# Altium schematic sheet MOTOR_CONTROL.SchDoc
size 558 x 431 mm; SheetNumber: 13; SheetTotal: 25; Sheet_Name: MOTOR CONTROL; Size: 11x17
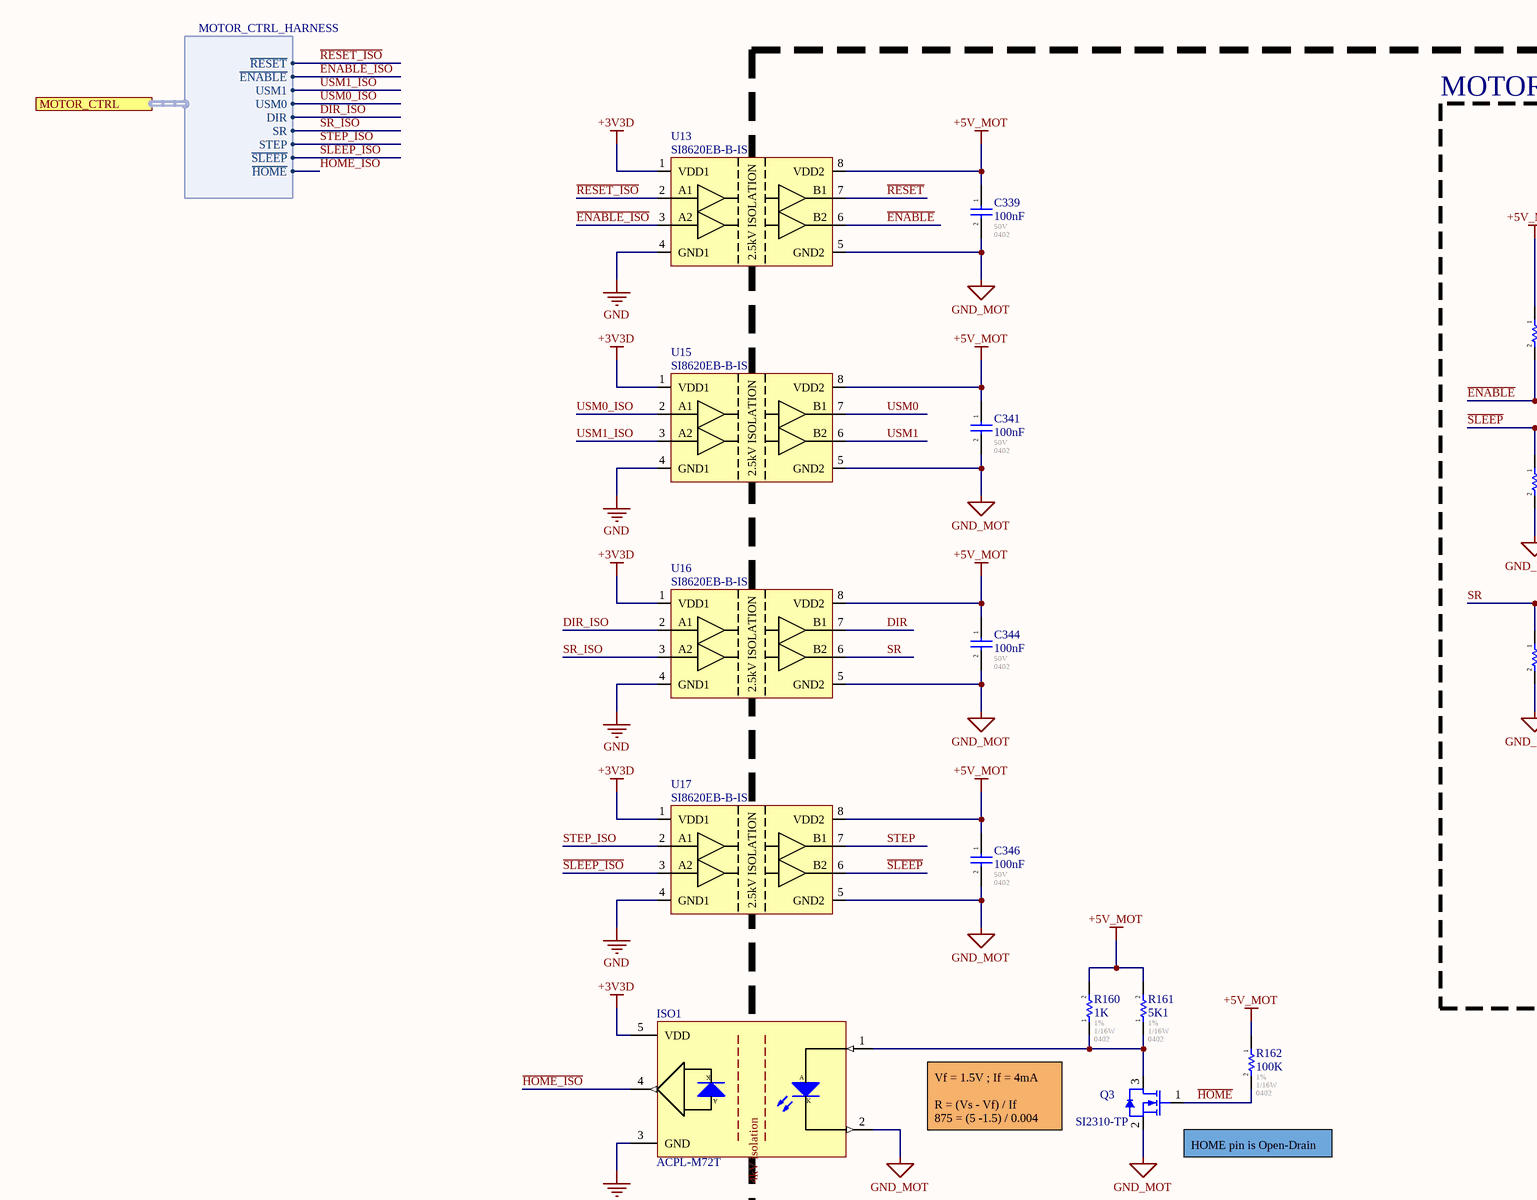
[diagram p0: MOTOR_CONTROL.SchDoc, top left]
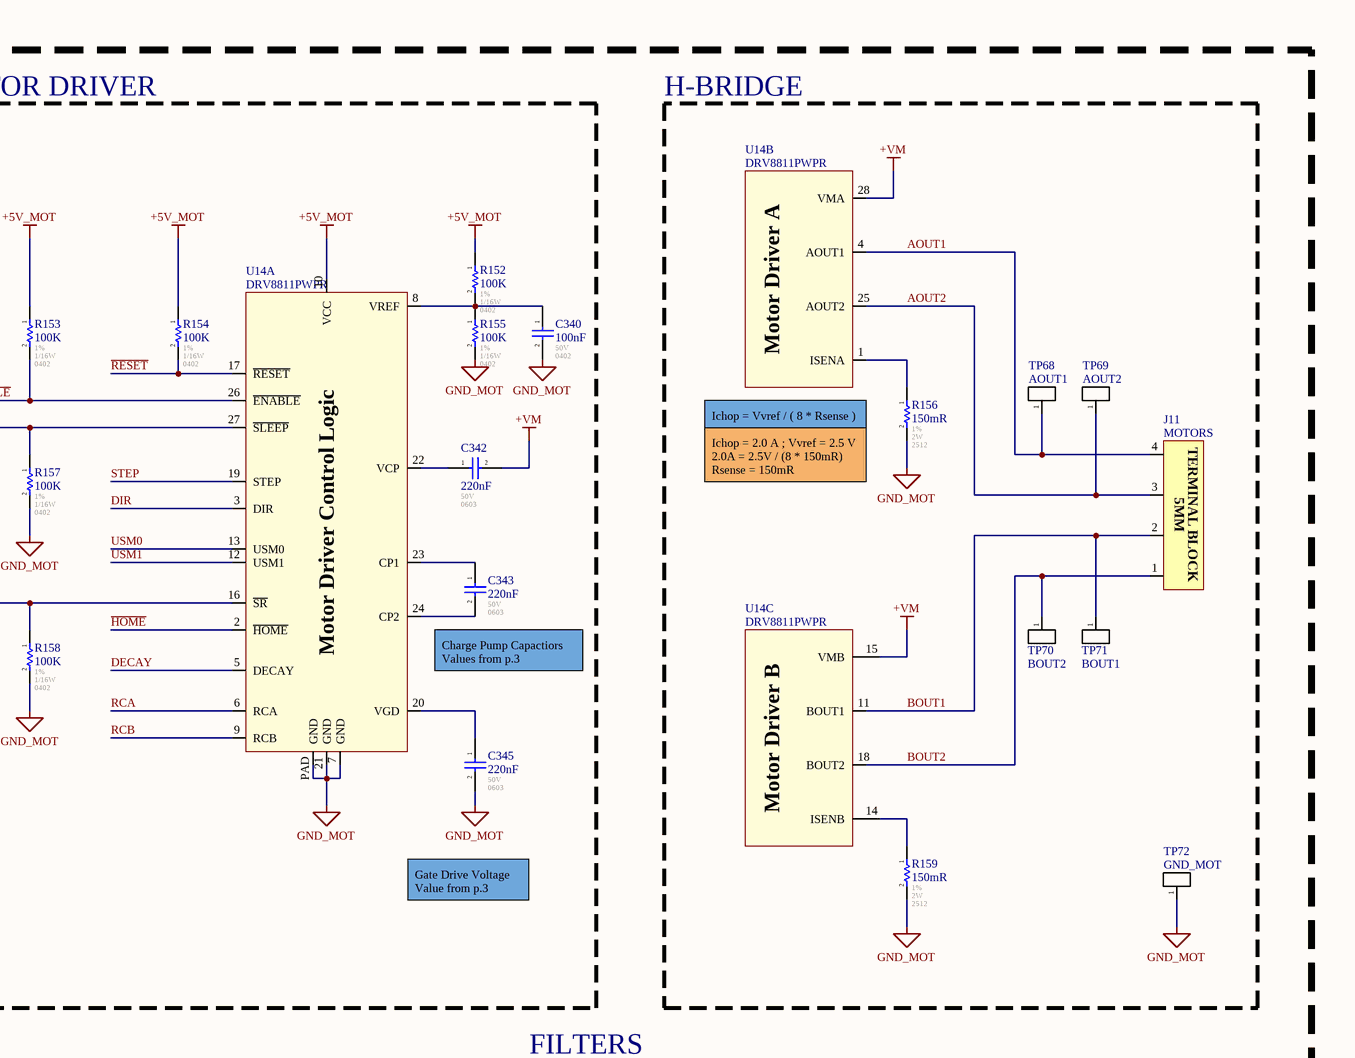
[diagram p1: MOTOR_CONTROL.SchDoc, top right]
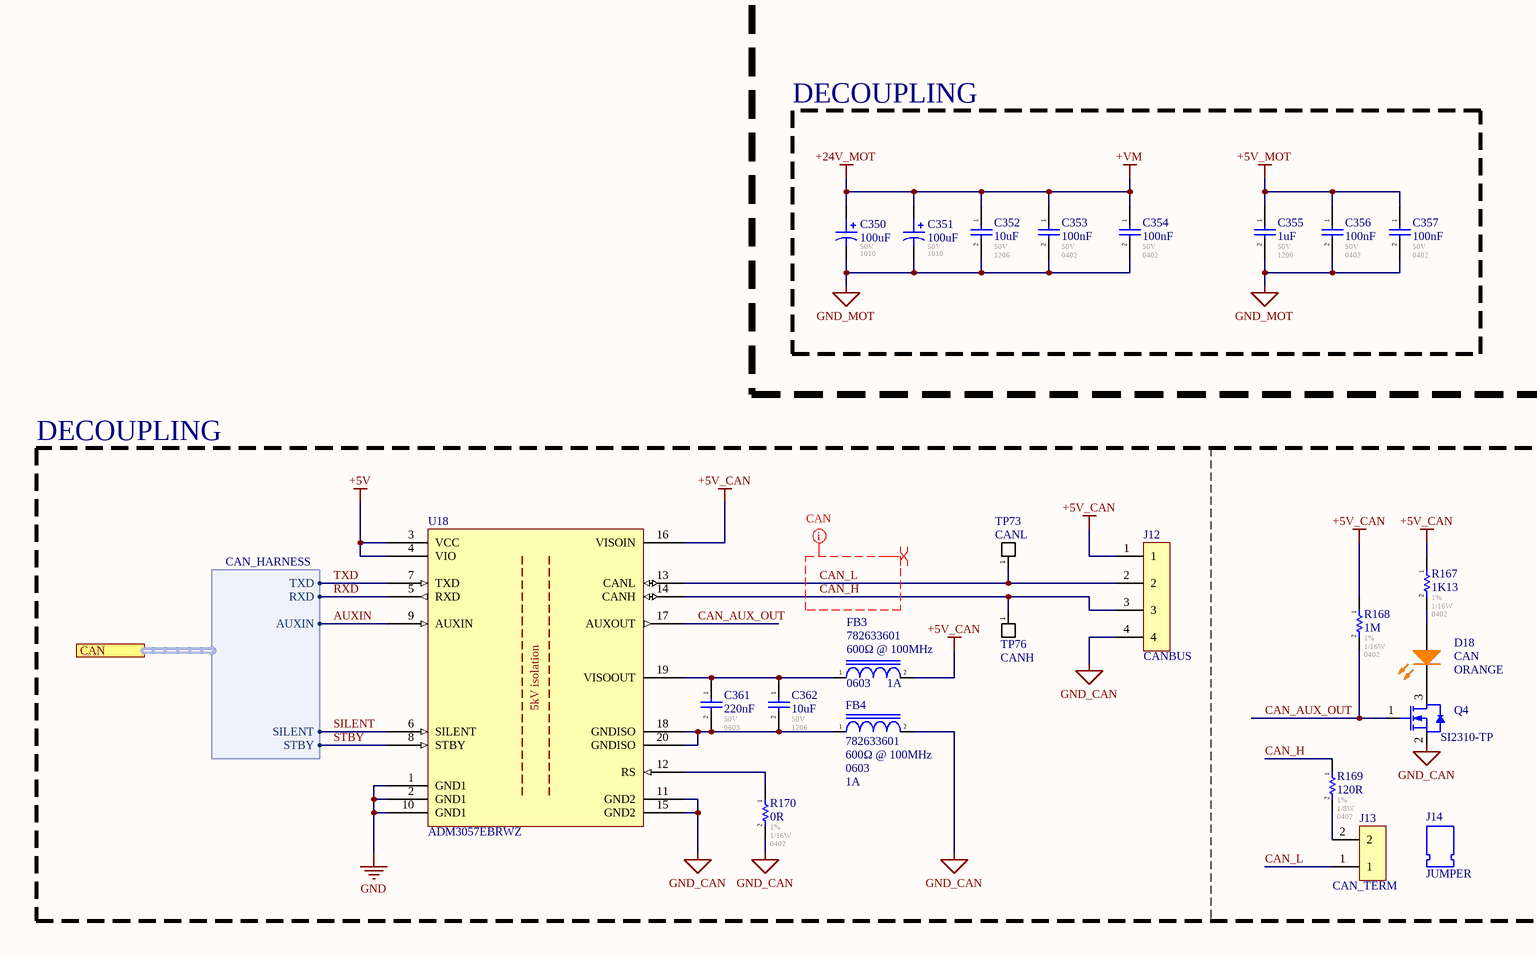
[diagram p2: MOTOR_CONTROL.SchDoc, bottom left]
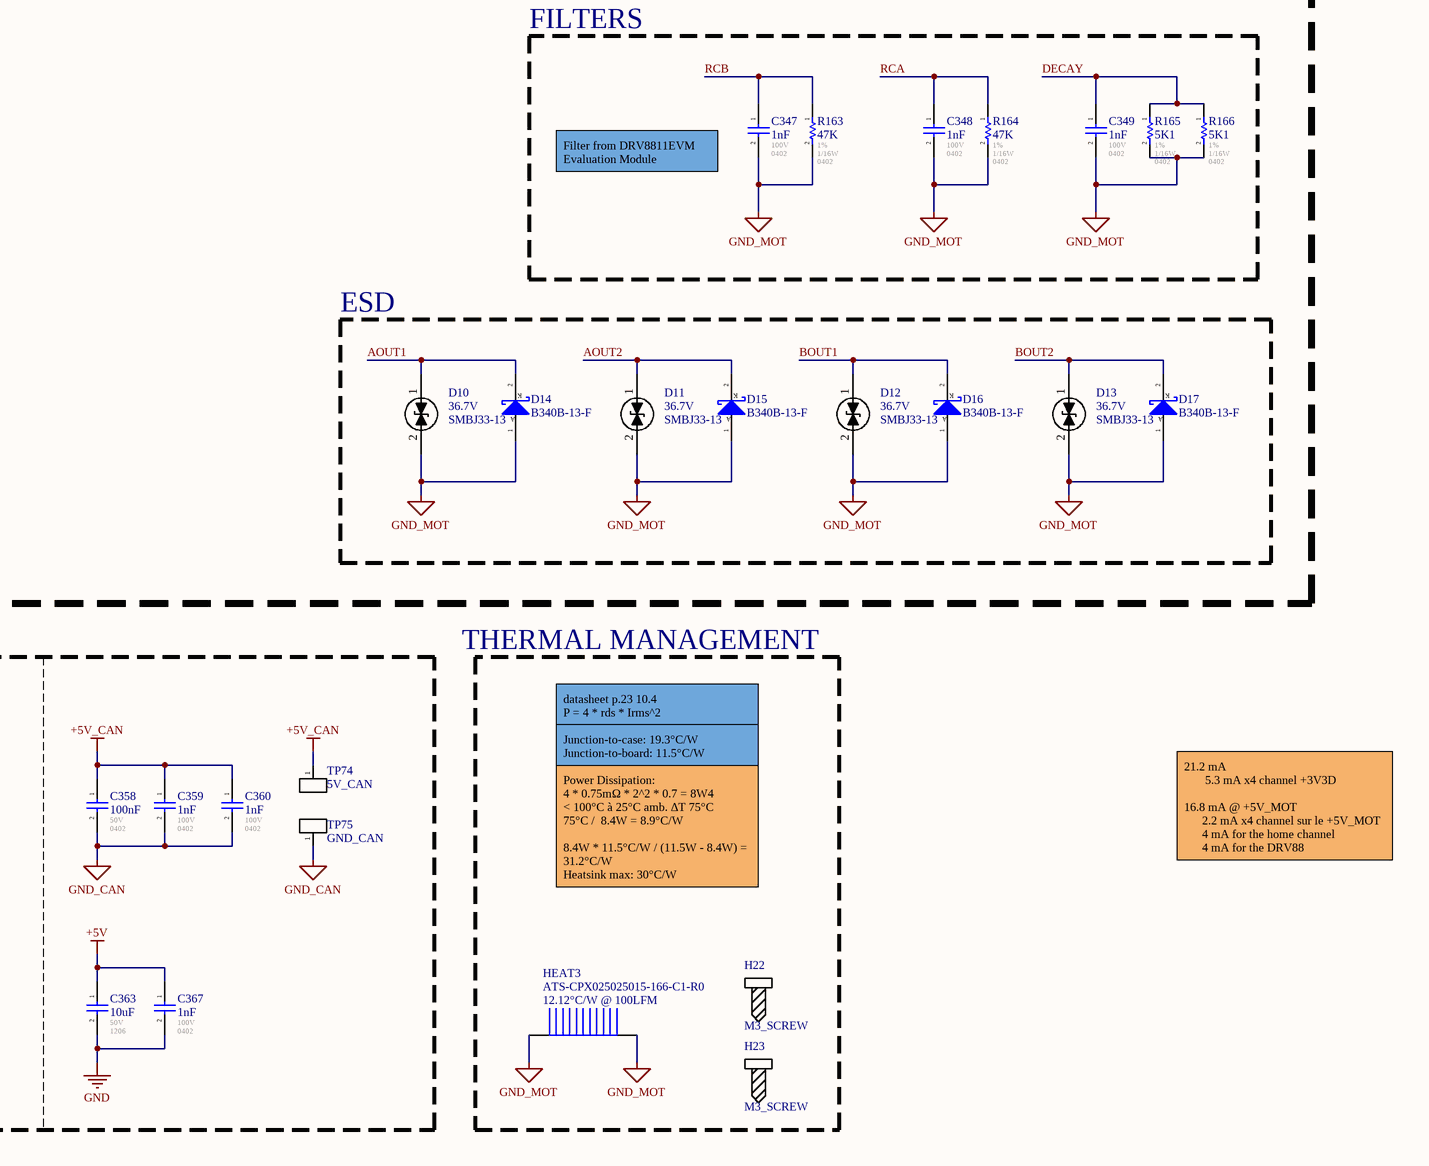
[diagram p3: MOTOR_CONTROL.SchDoc, bottom right]

## Parts
C339  100nF  Voltage - Rated: 50V  Footprint: 0402  [CAP_0402]
C340  100nF  Voltage - Rated: 50V  Footprint: 0402  [CAP_0402]
C341  100nF  Voltage - Rated: 50V  Footprint: 0402  [CAP_0402]
C342  220nF  Voltage - Rated: 50V  Footprint: 0603  [CAP_0603]
C343  220nF  Voltage - Rated: 50V  Footprint: 0603  [CAP_0603]
C344  100nF  Voltage - Rated: 50V  Footprint: 0402  [CAP_0402]
C345  220nF  Voltage - Rated: 50V  Footprint: 0603  [CAP_0603]
C346  100nF  Voltage - Rated: 50V  Footprint: 0402  [CAP_0402]
C347  1nF  Voltage - Rated: 100V  Footprint: 0402  [CAP_0402]
C348  1nF  Voltage - Rated: 100V  Footprint: 0402  [CAP_0402]
C349  1nF  Voltage - Rated: 100V  Footprint: 0402  [CAP_0402]
C350  value 100uF  Voltage: 50V  Package: 1010  [CAP_ALU_1010_vishay]  (hidden comment: MAL215099101E3)
C351  value 100uF  Voltage: 50V  Package: 1010  [CAP_ALU_1010_vishay]  (hidden comment: MAL215099101E3)
C352  10uF  Voltage - Rated: 50V  Footprint: 1206  [CAP_1206]
C353  100nF  Voltage - Rated: 50V  Footprint: 0402  [CAP_0402]
C354  100nF  Voltage - Rated: 50V  Footprint: 0402  [CAP_0402]
C355  1uF  Voltage - Rated: 50V  Footprint: 1206  [CAP_1206]
C356  100nF  Voltage - Rated: 50V  Footprint: 0402  [CAP_0402]
C357  100nF  Voltage - Rated: 50V  Footprint: 0402  [CAP_0402]
C358  100nF  Voltage - Rated: 50V  Footprint: 0402  [CAP_0402]
C359  1nF  Voltage - Rated: 100V  Footprint: 0402  [CAP_0402]
C360  1nF  Voltage - Rated: 100V  Footprint: 0402  [CAP_0402]
C361  220nF  Voltage - Rated: 50V  Footprint: 0603  [CAP_0603]
C362  10uF  Voltage - Rated: 50V  Footprint: 1206  [CAP_1206]
C363  10uF  Voltage - Rated: 50V  Footprint: 1206  [CAP_1206]
C367  1nF  Voltage - Rated: 100V  Footprint: 0402  [CAP_0402]
D10  SMBJ33-13  Voltage - Breakdown: 36.7V  [DO214AA (SMB)]
D11  SMBJ33-13  Voltage - Breakdown: 36.7V  [DO214AA (SMB)]
D12  SMBJ33-13  Voltage - Breakdown: 36.7V  [DO214AA (SMB)]
D13  SMBJ33-13  Voltage - Breakdown: 36.7V  [DO214AA (SMB)]
D14  B340B-13-F  [DO214AA (SMB)]
D15  B340B-13-F  [DO214AA (SMB)]
D16  B340B-13-F  [DO214AA (SMB)]
D17  B340B-13-F  [DO214AA (SMB)]
D18  CAN  value ORANGE  [LED_0603]
FB3  782633601  Impedance @ Freq: 600Ω @ 100MHz  Package / Case: 0603  Current Rating: 1A  [IND_0603]
FB4  782633601  Impedance @ Freq: 600Ω @ 100MHz  Package / Case: 0603  Current Rating: 1A  [IND_0603]
H22  M3_SCREW  (mechanical)
H23  M3_SCREW  (mechanical)
HEAT3  ATS-CPX025025015-166-C1-R0  Thermal Resistance: 12.12°C/W @ 100LFM  [ATS-CPX025025015-166-C1-R0]
ISO1  ACPL-M72T  [SOIC-5_4.4MM]
J11  MOTORS  [CONN_TERMINAL_OSTTA040161]
J12  CANBUS  [HEADER-4_100MIL]
J13  CAN_TERM  [HEADER-2_100MIL]
J14  JUMPER  (mechanical)
Q3  SI2310-TP  [TRX_NMOS_SI2310-TP]
Q4  SI2310-TP  [TRX_NMOS_SI2310-TP]
R152  100K  Tolerance: 1%  Power: 1/16W  Package / Case: 0402  [RES_0402]
R153  100K  Tolerance: 1%  Power: 1/16W  Package / Case: 0402  [RES_0402]
R154  100K  Tolerance: 1%  Power: 1/16W  Package / Case: 0402  [RES_0402]
R155  100K  Tolerance: 1%  Power: 1/16W  Package / Case: 0402  [RES_0402]
R156  150mR  Tolerance: 1%  Power: 2W  Package / Case: 2512  [RES_2512]
R157  100K  Tolerance: 1%  Power: 1/16W  Package / Case: 0402  [RES_0402]
R158  100K  Tolerance: 1%  Power: 1/16W  Package / Case: 0402  [RES_0402]
R159  150mR  Tolerance: 1%  Power: 2W  Package / Case: 2512  [RES_2512]
R160  1K  Tolerance: 1%  Power: 1/16W  Package / Case: 0402  [RES_0402]
R161  5K1  Tolerance: 1%  Power: 1/16W  Package / Case: 0402  [RES_0402]
R162  100K  Tolerance: 1%  Power: 1/16W  Package / Case: 0402  [RES_0402]
R163  47K  Tolerance: 1%  Power: 1/16W  Package / Case: 0402  [RES_0402]
R164  47K  Tolerance: 1%  Power: 1/16W  Package / Case: 0402  [RES_0402]
R165  5K1  Tolerance: 1%  Power: 1/16W  Package / Case: 0402  [RES_0402]
R166  5K1  Tolerance: 1%  Power: 1/16W  Package / Case: 0402  [RES_0402]
R167  1K13  Tolerance: 1%  Power: 1/16W  Package / Case: 0402  [RES_0402]
R168  1M  Tolerance: 1%  Power: 1/16W  Package / Case: 0402  [RES_0402]
R169  120R  Tolerance: 1%  Power: 1/8W  Package / Case: 0402  [RES_0402]
R170  0R  Tolerance: 1%  Power: 1/16W  Package / Case: 0402  [RES_0402]
TP68  AOUT1  [TP_HOLE]  (no BOM)
TP69  AOUT2  [TP_HOLE]  (no BOM)
TP70  BOUT2  [TP_HOLE]  (no BOM)
TP71  BOUT1  [TP_HOLE]  (no BOM)
TP72  GND_MOT  [TP_HOLE]  (no BOM)
TP73  CANL  [TP_PAD]  (no BOM)
TP74  5V_CAN  [TP_HOLE]  (no BOM)
TP75  GND_CAN  [TP_HOLE]  (no BOM)
TP76  CANH  [TP_PAD]  (no BOM)
U13  SI8620EB-B-IS  [ISO_SI8620EB-B-IS]
U14  DRV8811PWPR  [POW_MOTOR_DRV8811PWPR]  (parts A,B,C of 3)
U15  SI8620EB-B-IS  [ISO_SI8620EB-B-IS]
U16  SI8620EB-B-IS  [ISO_SI8620EB-B-IS]
U17  SI8620EB-B-IS  [ISO_SI8620EB-B-IS]
U18  ADM3057EBRWZ  [SOIC-20_7.5mm]

## Blocks framed on the sheet
MOTOR DRIVER: C340 C342 C343 C345 R152-R155 R157 R158 U14
H-BRIDGE: J11 R156 R159 TP68-TP72 U14
FILTERS: C347-C349 R163-R166
DECOUPLING: C350-C357
ESD: D10-D17
DECOUPLING: C358-C363 C367 D18 FB3 FB4 J12-J14 Q4 R167-R170 TP73-TP76 U18

## Ports
CAN (harness CAN_HARNESS), MOTOR_CTRL (harness MOTOR_CTRL_HARNESS)

## Harnesses
MOTOR_CTRL_HARNESS: DIR, SR, STEP, ~{SLEEP}, ~{HOME}, USM1, USM0, ~{RESET}, ~{ENABLE}
CAN_HARNESS: TXD, RXD, AUXIN, SILENT, STBY

## Nets
+3V3D: ISO1.5(VDD) U13.1(VDD1) U15.1(VDD1) U16.1(VDD1) U17.1(VDD1)
+5V: C363.1 C367.1 U18.3(VCC) U18.4(VIO)
+5V_CAN: C358.1 C359.1 C360.1 FB3.2 J12.1 R167.1 R168.1 TP74.1(A) U18.16(VISOIN)
+5V_MOT: C339.1 C341.1 C344.1 C346.1 C355.1 C356.1 C357.1 R152.1 R153.1 R154.1 R160.2 R161.2 R162.1 U13.8(VDD2) U14.10(VCC) U15.8(VDD2) U16.8(VDD2) U17.8(VDD2)
+24V_MOT: C342.2 C350.1 C351.1 C352.1 C353.1 C354.1 U14.15(VMB) U14.28(VMA)  [also labelled +VM]
GND: C363.2 C367.2 ISO1.3(GND) U13.4(GND1) U15.4(GND1) U16.4(GND1) U17.4(GND1) U18.1(GND1) U18.2(GND1) U18.10(GND1)
GND_CAN: C358.2 C359.2 C360.2 FB4.2 J12.4 Q4.2(S) R170.2 TP75.1(A) U18.11(GND2) U18.15(GND2)
GND_MOT: C339.2 C340.2 C341.2 C344.2 C345.2 C346.2 C347.2 C348.2 C349.2 C350.2 C351.2 C352.2 C353.2 C354.2 C355.2 C356.2 C357.2 D10.2(C) D11.2(C) D12.2(C) D13.2(C) D14.1(A) D15.1(A) D16.1(A) D17.1(A) HEAT3.1 HEAT3.2 ISO1.2(CATHODE) Q3.2(S) R155.2 R156.2 R157.2 R158.2 R159.2 R163.2 R164.2 R165.2 R166.2 TP72.1(A) U13.5(GND2) U14.7(GND) U14.21(GND) U14.PAD(GND) U15.5(GND2) U16.5(GND2) U17.5(GND2)
~{ENABLE}: R153.2 U13.6(B2) U14.26(~{ENABLE})
~{ENABLE_ISO}: U13.3(A2) ; port MOTOR_CTRL.~{ENABLE}
~{HOME}: Q3.1(G) R162.2 U14.2(~{HOME})
~{HOME_ISO}: ISO1.4(VOUT) ; port MOTOR_CTRL.~{HOME}
~{RESET}: R154.2 U13.7(B1) U14.17(~{RESET})
~{RESET_ISO}: U13.2(A1) ; port MOTOR_CTRL.~{RESET}
~{SLEEP}: R157.1 U14.27(~{SLEEP}) U17.6(B2)
~{SLEEP_ISO}: U17.3(A2) ; port MOTOR_CTRL.~{SLEEP}
AOUT1: D10.1(A) D14.2(K) J11.4 TP68.1(A) U14.4(AOUT1)
AOUT2: D11.1(A) D15.2(K) J11.3 TP69.1(A) U14.25(AOUT2)
AUXIN: U18.9(AUXIN) ; port CAN.AUXIN
BOUT1: D12.1(A) D16.2(K) J11.2 TP71.1(A) U14.11(BOUT1)
BOUT2: D13.1(A) D17.2(K) J11.1 TP70.1(A) U14.18(BOUT2)
CAN_AUX_OUT: Q4.1(G) R168.2 U18.17(AUXOUT)
CAN_H: J12.3 R169.1 TP76.1(A) U18.14(CANH)
CAN_L: J12.2 J13.1 TP73.1(A) U18.13(CANL)
DECAY: C349.1 R165.1 R166.1 U14.5(DECAY)
DIR: U14.3(DIR) U16.7(B1)
DIR_ISO: U16.2(A1) ; port MOTOR_CTRL.DIR
RCA: C348.1 R164.1 U14.6(RCA)
RCB: C347.1 R163.1 U14.9(RCB)
RXD: U18.5(RXD) ; port CAN.RXD
SILENT: U18.6(SILENT) ; port CAN.SILENT
SR: R158.1 U14.16(~{SR}) U16.6(B2)
SR_ISO: U16.3(A2) ; port MOTOR_CTRL.SR
STBY: U18.8(STBY) ; port CAN.STBY
STEP: U14.19(STEP) U17.7(B1)
STEP_ISO: U17.2(A1) ; port MOTOR_CTRL.STEP
TXD: U18.7(TXD) ; port CAN.TXD
USM0: U14.13(USM0) U15.7(B1)
USM0_ISO: U15.2(A1) ; port MOTOR_CTRL.USM0
USM1: U14.12(USM1) U15.6(B2)
USM1_ISO: U15.3(A2) ; port MOTOR_CTRL.USM1
NetC340_1: C340.1 R152.2 R155.1 U14.8(VREF)
NetC342_1: C342.1 U14.22(VCP)
NetC343_1: C343.1 U14.23(CP1)
NetC343_2: C343.2 U14.24(CP2)
NetC345_1: C345.1 U14.20(VGD)
NetC361_1: C361.1 C362.1 FB3.1 U18.19(VISOOUT)
NetC361_2: C361.2 C362.2 FB4.1 U18.18(GNDISO) U18.20(GNDISO)
NetD18_1: D18.1(A) R167.2
NetD18_2: D18.2(K) Q4.3(D)
NetISO1_1: ISO1.1(ANODE) Q3.3(D) R160.1 R161.1
NetJ13_2: J13.2 R169.2
NetR156_1: R156.1 U14.1(ISENA)
NetR159_1: R159.1 U14.14(ISENB)
NetR170_1: R170.1 U18.12(RS)

## Layout directives
differential pair: CAN_H, CAN_L
net class CAN: CAN_H, CAN_L

## Notes on the sheet
- (near R156) Ichop = 2.0 A ; Vvref = 2.5 V
  2.0A = 2.5V / (8 * 150mR)
  Rsense = 150mR
- Ichop = Vvref / ( 8 * Rsense )
- Charge Pump Capactiors
  Values from p.3
- Gate Drive Voltage
  Value from p.3
- (near R160) Vf = 1.5V ; If = 4mA
  R = (Vs - Vf) / If
  875 = (5 -1.5) / 0.004
- (near Q3) HOME pin is Open-Drain
- (near C347) Filter from DRV8811EVM Evaluation Module
- THERMAL MANAGEMENT
- datasheet p.23 10.4
  P = 4 * rds * Irms^2
- Junction-to-case: 19.3°C/W
  Junction-to-board: 11.5°C/W
- 21.2 mA
  5.3 mA x4 channel +3V3D
  16.8 mA @ +5V_MOT
  2.2 mA x4 channel sur le +5V_MOT
  4 mA for the home channel
  4 mA for the DRV88
- Power Dissipation:
  4 * 0.75mΩ * 2^2 * 0.7 = 8W4
  < 100°C à 25°C amb. ΔT 75°C
  75°C /  8.4W = 8.9°C/W
  8.4W * 11.5°C/W / (11.5W - 8.4W) = 31.2°C/W
  Heatsink max: 30°C/W
- Sheet Name
- Project Title
- Global Project
- Revision
- Size
- Date
- Group
- Sheet
- of
- Filename
- Designers
- (in symbol ACPL-M72T) K; A; 4kV isolation
- (in symbol ADM3057EBRWZ) 5kV isolation
- (in symbol CONN_TERMINAL_OSTTC040162) 5MM; TERMINAL BLOCK
- (in symbol ISO_SI8620EB-B-IS) 2.5kV ISOLATION
- (in symbol POW_MOTOR_DRV8811PWPR, part A) Motor Driver Control Logic
- (in symbol POW_MOTOR_DRV8811PWPR, part B) Motor Driver A
- (in symbol POW_MOTOR_DRV8811PWPR, part C) Motor Driver B

## Library data of the parts
C339-C341 C344 C346 C353 C354 C356-C358 = CAP_CER: GCM155R71H104KE02J / 0402 100nF 10% X7R Ceramic Capacitor; Mfr: Murata; Operating Temperature: -55C - 125C; Temperature Coefficient: X7R; ComponentLink1Description: Digikey; ComponentLink1URL: [Digikey Link]; Part#: GCM155R71H104KE02J; ComponentLink2Description: Datasheet; ComponentLink2URL: [Datasheet Link]; Tolerance: 10%; Ratings: AEC-Q200
C342 C343 C345 C361 = CAP_CER: GCM188R71H224KA64D / 0603 220nF 10% X7R Ceramic Capacitor; Mfr: Murata; Operating Temperature: -55C - 125C; Temperature Coefficient: X7R; ComponentLink1Description: Digikey; ComponentLink1URL: [Digikey Link]; Part#: GCM188R71H224KA64D; ComponentLink2Description: Datasheet; ComponentLink2URL: [Datasheet Link]; Tolerance: 10%; Ratings: AEC-Q200
C347-C349 C359 C360 C367 = CAP_CER: GCM155R72A102KA37D / 0402 1nF 10% X7R Ceramic Capacitor; Mfr: Murata; Operating Temperature: -55C - 125C; Temperature Coefficient: X7R; ComponentLink1Description: Digikey; ComponentLink1URL: [Digikey Link]; Part#: GCM155R72A102KA37D; ComponentLink2Description: Datasheet; ComponentLink2URL: [Datasheet Link]; Tolerance: 10%; Ratings: AEC-Q200
C350 C351 = CAP_ALU_MAL215099101E3: CAP - ALU 100uF 20% 50V - 1010; Current: 490mA; Mfg: Vishay Dale; Mfg Part Number: MAL215099101E3; HelpURL: http://www.vishay.com/docs/28395/150crz.pdf; CreatedBy: Jonathan Bouchard; Temperature: -55°C to 125°C; Power: *; Supplier 1: Digikey; Supplier Part Number 1: 4399PHDKR-ND; Precision: 20%
C352 C362 C363 = CAP_CER: GRT31CR61H106KE01L / 1206 10uF 10% X5R Ceramic Capacitor; Mfr: Murata; Operating Temperature: -55C - 85C; Temperature Coefficient: X5R; ComponentLink1Description: Digikey; ComponentLink1URL: [Digikey Link]; ComponentLink2Description: Datasheet; ComponentLink2URL: [Datasheet Link]; Tolerance: 10%; Ratings: AEC-Q200; Part#: GRT31CR61H106KE01L
  C362 C363: Supplier 1: Arrow Electronics; Supplier Part Number 1: GRT31CR61H106KE01L
C355 = CAP_CER: GCJ31CR71H105KA12L / 1206 1uF 10% X7R Ceramic Capacitor; Mfr: Murata; Operating Temperature: -55C - 125C; Temperature Coefficient: X7R; ComponentLink1Description: Digikey; ComponentLink1URL: [Digikey Link]; Part#: GCJ31CR71H105KA12L; ComponentLink2Description: Datasheet; ComponentLink2URL: [Datasheet Link]; Tolerance: 10%; Ratings: AEC-Q200
D10-D13 = DIODE_TVS: 53.3V Clamp 11.3A Ipp Tvs Diode Surface Mount SMB; Mfr: SMBJ33CAQ-13-F; Voltage - Reverse: 33V; Operating Temperature: *; Package / Case: SMB; Current: 11.3A; ComponentLink1Description: Digikey; ComponentLink1URL: https://www.digikey.ca/en/products/detail/diodes-incorporated/SMBJ33CAQ-13-F/9738859
D14-D17 = DIODE_SHOTTKEY: Generic Shottkey Diode; Mfr: Diodes Incorporated; Diode Type: Schottky; Current: 3A; Reverse Voltage: 40V; Forward Voltage: 500mV @ 3A; Qualification: AEC-Q101; Package / Case: SMB; ComponentLink1Description: Digikey; ComponentLink1URL: https://www.digikey.ca/en/products/detail/diodes-incorporated/B340B-13-F/768869; ComponentLink2Description: Octopart; ComponentLink2URL: https://octopart.com/b340b-13-f-diodes+inc.-325817?r=sp; Supplier 1: Future Electronics; Supplier Part Number 1: 6160261
D18 = LED_SML-311DTT86: LED - 611nM ORANGE 2mA - 0603; Voltage: 1.8V; Mfg: ROHM Semiconductor; Power: 44mW; Current: 2mA; HelpURL: http://media.digikey.com/pdf/Data%20Sheets/Rohm%20PDFs/SML-311%20Series.pdf; CreatedBy: Jonathan Bouchard; Temperature: -40°C to 85°C; Package: 0603; Precision: *; Mfg Part Number: SML-311DTT86; Supplier 1: Digikey; Supplier Part Number 1: 511-1303-1-ND
FB3 FB4 = FERRITE_BEAD: 600 Ohms @ 100 MHz 1 Signal Line Ferrite Bead 0603 (1608 Metric) 1A 200mOhm; Manufacturer: Wurth Elektronik; Resistance: 200mR; Operating Temperature: -55C - 125C; Rating: AEC-Q200; ComponentLink1Description: Digikey; ComponentLink1URL: https://www.digikey.ca/en/products/detail/w%C3%BCrth-elektronik/782633601/5168802; ComponentLink3Description: Octopart; ComponentLink3URL: https://octopart.com/782633601-wurth+elektronik-56466764; Supplier 1: Digikey; Supplier Part Number 1: 732-6703-1-ND; ComponentLink5Description: Datasheet; ComponentLink5URL: https://www.we-online.com/components/products/datasheet/782633601.pdf
HEAT3 = HEATSINK_ATS-CPX025025015-166-C1-R0: Heatsink Aluminium; Mfr: Advanced Thermal Solutions Inc.; Hole Size: 3.175mm; Hole-to-hole: 42.42mm; Fin Height: 15mm; Length: 25mm; Width: 25mm; Material: Aluminium; ComponentLink1Description: Digikey; ComponentLink1URL: https://www.digikey.ca/en/products/detail/advanced-thermal-solutions-inc/ATS-CPX025025015-166-C1-R0/4753829; ComponentLink2Description: Mfr; ComponentLink2URL: https://www.qats.com/Search/HeatSink/2670.aspx; Supplier 1: Digikey; Supplier Part Number 1: ATS35911-ND
ISO1 = ACPL-M72T: Logic Output Optoisolator Push-Pull, Totem Pole 4000Vrms 1 Channel 25kV/µs CMTI 5-SO; Mfr: Broadcom Limited; Number of channels: 1; Common Mode Transient: 25kV/us; Voltage - Forward: 1.5V; Current - Forward: 20mA; Voltage - Supply: 3V - 5.5V; Qualification: AEC-Q100; Voltage - Isolation: 4000Vrms; Output Topology: Push-Pull; Operating Temperature: -40C - 125C; Package: SOIC6 - 5 Leads; ComponentLink1Description: Digikey; ComponentLink1URL: https://www.digikey.ca/en/products/detail/broadcom-limited/ACPL-M72T-000E/2347227; ComponentLink2Description: Datasheet; ComponentLink2URL: https://docs.broadcom.com/doc/AV02-2180EN
J11 = CONN_TERMINAL_OSTTC040162: CONN -  TERMINAL BLOCK 4POS 5MM - TH; Mfg: On Shore Technology Inc.; Voltage: *; Current: *; Power: *; Mfg Part Number: OSTTC040162; HelpURL: http://www.on-shore.com/wp-content/uploads/2015/09/osttcxx0162.pdf; CreatedBy: Jonathan Bouchard; Temperature: -30°C ~ 105°C; Value: *; Precision: *; Package: TH-4; Supplier 1: Digikey; Supplier Part Number 1: ED2602-ND
J12 = HEADER_4
J13 = HEADER_2
Q3 Q4 = TRX_NMOS_SI2310-TP: TRX - MOSFET N-CH 60V 3A - SOT-23; Manufacturer #1: Micro Commercial Co; Power Max: 350mW; Voltage rating: 60V (Vds max), 2V (Vgs @ 250uA); Polarized: Yes; Magnetic Material: UNKNOWN; GRAMS Lib Spec: 2.8c; Current Rating: 3A; Manufacturer #2: *; Value: *; Part Number #1: SI2310-TP; Part Number #2: *; HelpURL: https://www.mccsemi.com/pdf/Products/SI2310(SOT-23)-A.pdf; Supplier 1: Digi-Key; Supplier Part Number 1: SI2310-TPMSCT-ND; Assembly Type: SMD; Temperature: -55°C ~ 150°C (TJ); Package: SOT-23; CreatedBy/Date: Louis-Daniel Gaulin / 20-02-2020; Tolerance: *; VerifiedBy: C.Paulin - 21/02/2020; Cryo: UNKNOWN
R152-R155 R157 R158 R160-R167 R169 R170 = RESISTOR: Automotive: AEC-Q200; Operating Temperature: *; # Digikey: *; ComponentLink1Description: Digikey; ComponentLink1URL: *; # Manufacturer: *
R156 R159 = RESISTOR: CSRN2512FKR150; Automotive: AEC-Q200; Operating Temperature: -55C - 155C; ComponentLink1Description: Digikey; ComponentLink1URL: https://www.digikey.ca/fr/products/detail/stackpole-electronics-inc/CSRN2512FKR150/1788109; Part #: CSRN2512FKR150
R168 = RESISTOR: 1M 0402 1% 1/16W Resistor; Automotive: AEC-Q200; Operating Temperature: *; # Digikey: *; ComponentLink1Description: Digikey; ComponentLink1URL: *; # Manufacturer: *
TP68-TP72 TP74 TP75 = TESTPOINT: Test Point; ClassName: Testpoint
TP73 TP76 = TESTPOINT_PAD: Test Point
U13 U15-U17 = ISO_SI8620EB-B-IS: ISO - Dual-Channel Digital Isolator (default HI) - 8-SOIC; Manufacturer #1: Silicon Labs; Voltage Rating: 2.5-5.5V; GRAMS Lib Spec: 2.8; Magnetic Material: Unknown; Polarized: Yes; Value: *; Tolerance: *; Current Rating: *; Power Max: *; HelpURL: https://www.silabs.com/documents/public/data-sheets/si861x-2x-datasheet.pdf; CreatedBy/Date: Joel Lemay 2018-06-05; VerifiedBy: Caroline Paulin - 12 sept 2018; Temperature: -40°C ~ 125°C; Package: 8-SOIC; Manufacturer #2: *; Assembly Type: SMD; Part Number #2: *; Part Number #1: SI8620EB-B-IS; Supplier 1: Digi-Key; Supplier Part Number 1: SI8620EB-B-IS-ND; Cryo: UNKNOWN
U14 = POW_MOTOR_DRV8811PWPR: POW - STEPPER MOTOR DRIVER - SOP-28; Voltage: 3 V ~ 5.5 V / 8 V ~ 38 V; Mfg: Texas Instrument; Current: *; Power: *; Mfg Part Number: DRV8811PWPR; HelpURL: http://www.ti.com/lit/ds/symlink/drv8811.pdf; CreatedBy: Jonathan Bouchard; Temperature: -40°C ~ 150°C (TJ); Value: *; Precision: *; Package: SOP-28; Supplier 1: Digikey; Supplier Part Number 1: 296-24591-1-ND
U18 = ADM3057EBRWZ: 1/1 Transceiver, Isolated CANbus 20-SOIC; Mfr: Analog Devices; Protocol: CAN; Data Rate: 12Mbps; Mode: Full Duplex; Voltage - Supply: 0.5V - 6V; Isolation: 5kV; Number of Drivers: 1/1; Operating Temperature: -40C - 105C; ComponentLink1Description: Digikey; ComponentLink1URL: https://www.digikey.ca/en/products/detail/analog-devices-inc/ADM3057EBRWZ/9806175; ComponentLink2Description: Datasheet; ComponentLink2URL: https://www.analog.com/media/en/technical-documentation/data-sheets/ADM3055E-3057E.pdf; ComponentLink3Description: Analog Devices; ComponentLink3URL: https://www.analog.com/en/products/adm3057e.html; ComponentLink4Description: Octopart; ComponentLink4URL: https://octopart.com/adm3057ebrwz-analog+devices-96773388?r=sp; Supplier 1: Mouser; Supplier Part Number 1: 584-ADM3057EBRWZ